# Altium schematic sheet Flomio BLE-NFC - Power.SchDoc: Flomio BLE-NFC::Power
size Tabloid; Author: Alex J. Tucker; CompanyName: Anidea Engineering, Inc.; DrawnBy: Alex J. Tucker; Engineer: Alex J. Tucker; Organization: Anidea Engineering, Inc.; Address1: 8020 Belvedere Rd.; Address2: Ste #1; Address3: West Palm Beach, FL; Address4: 33411    USA; DocumentNumber: 5; Revision: 3; SheetNumber: 5; SheetTotal: 5
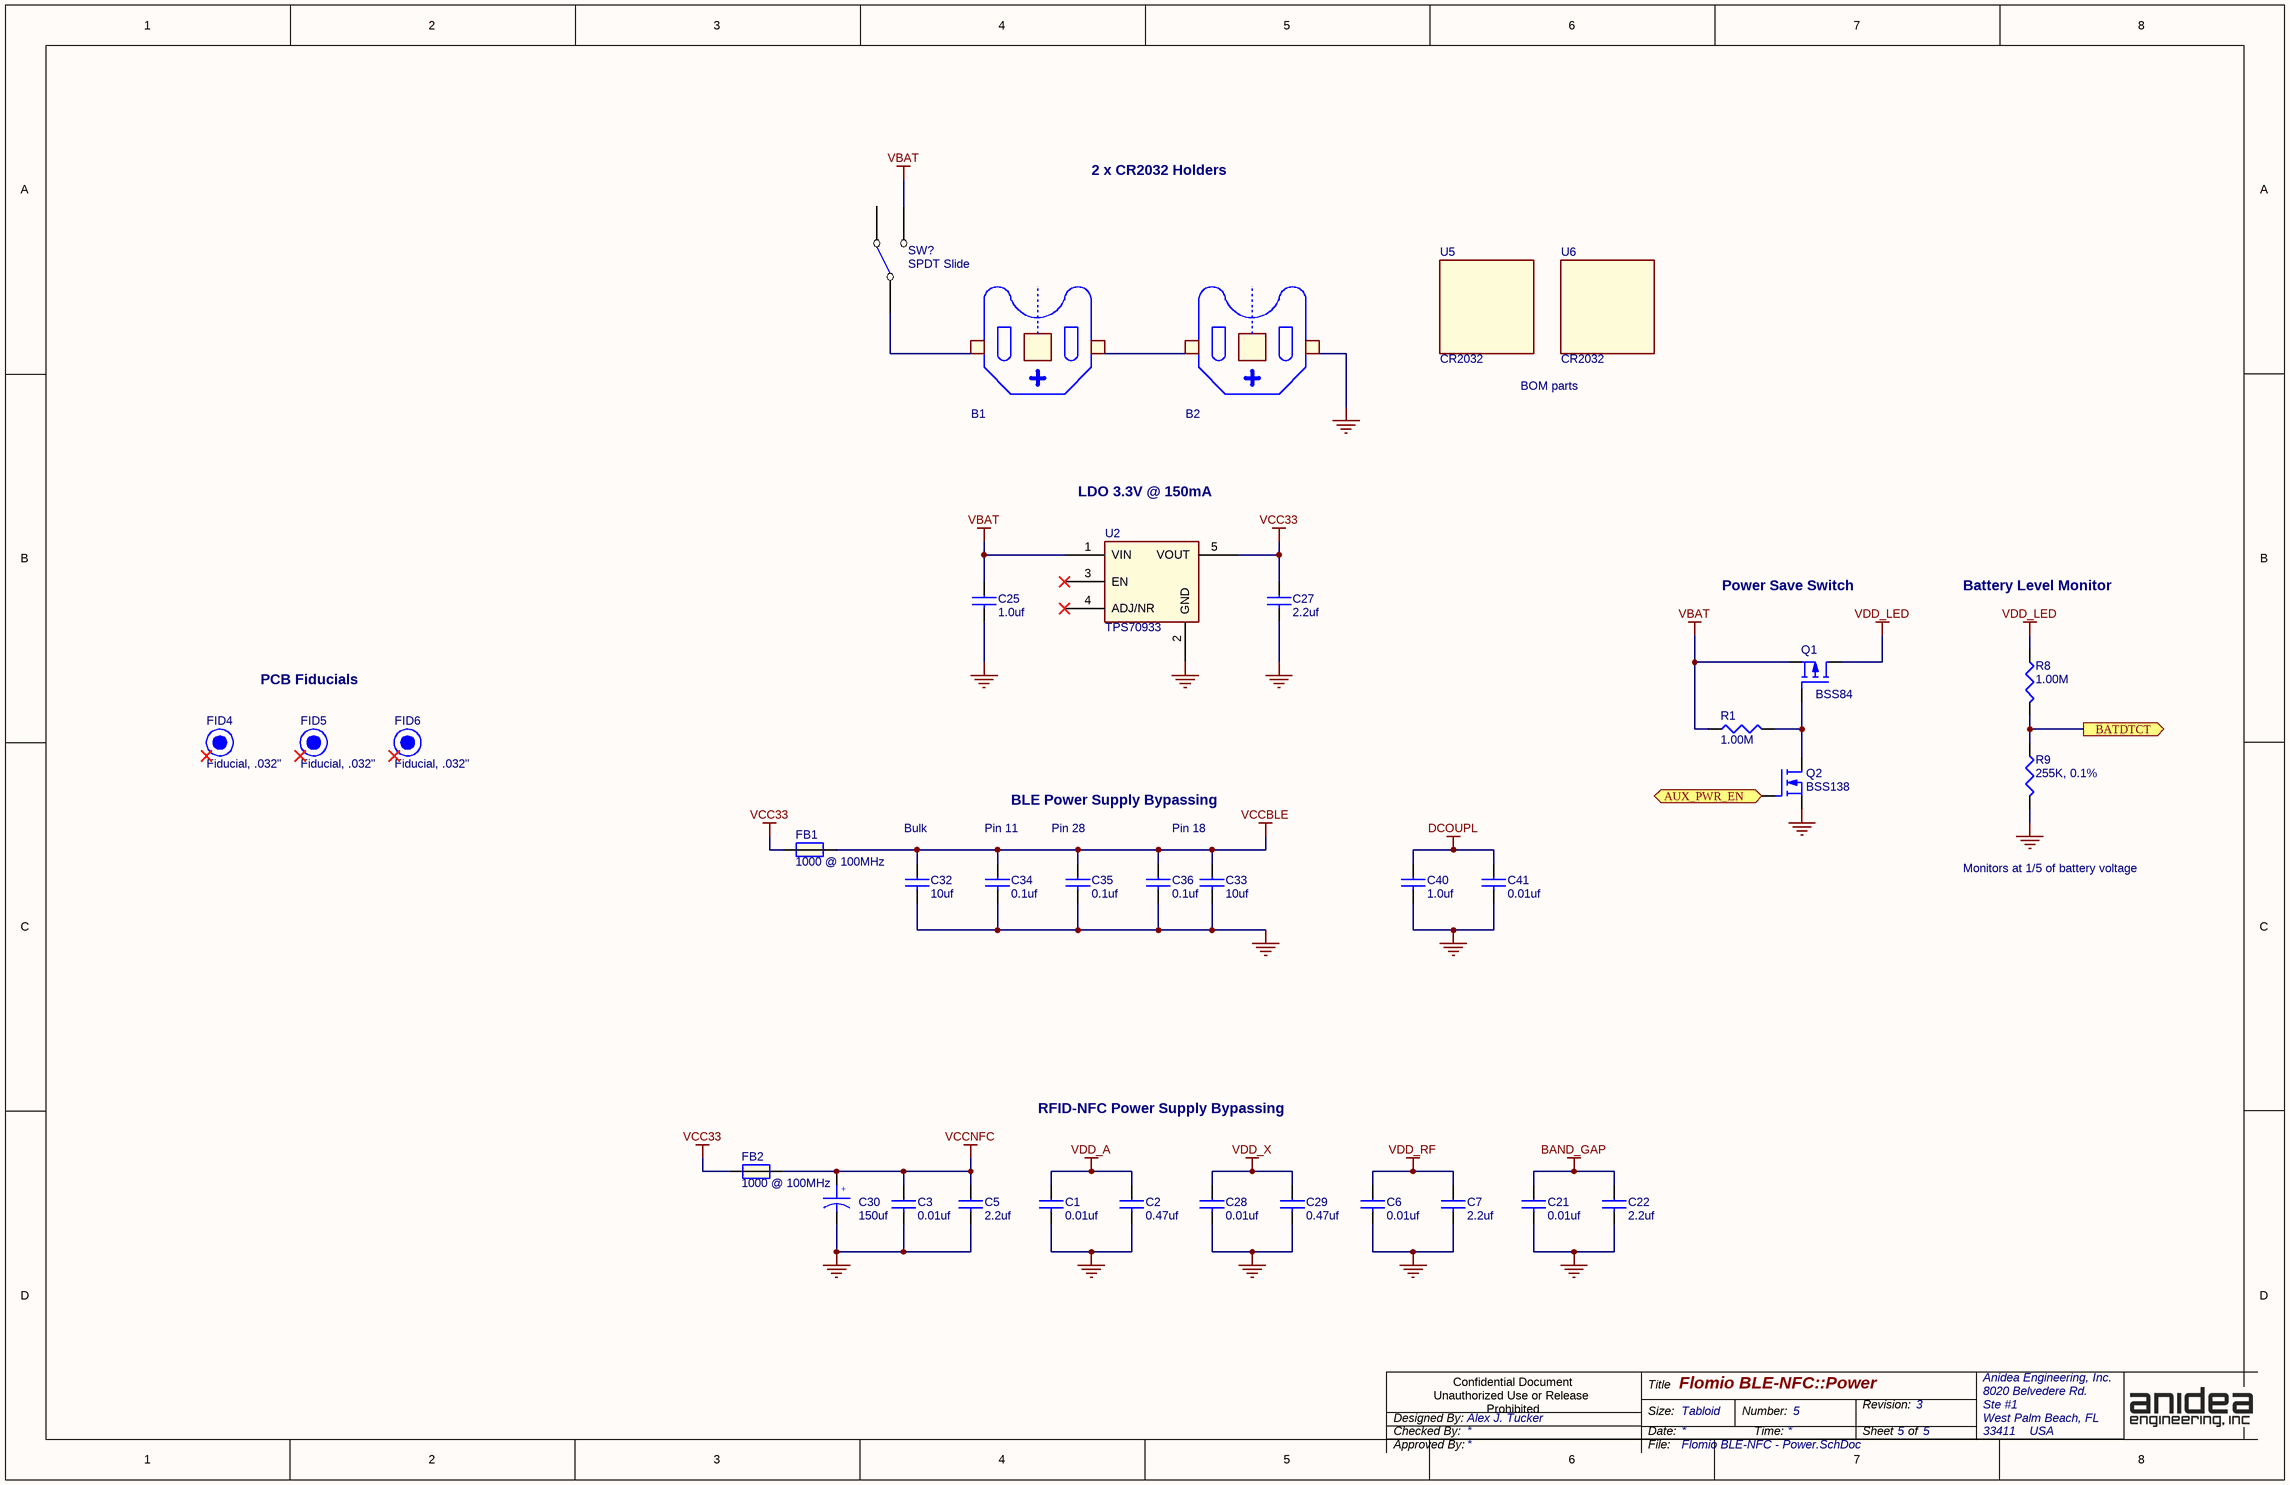
[diagram p0: Flomio BLE-NFC - Power.SchDoc]

## Parts
B1  CLIP  [BATT/BK-912]  (value not drawn)
B2  CLIP  [BATT/BK-912]  (value not drawn)
C1  0.01uf  [SM/C_0603]
C2  0.47uf  [SM/C_0603]
C3  0.01uf  [SM/C_0603]
C5  2.2uf  [SM/C_0603]
C6  0.01uf  [SM/C_0603]
C7  2.2uf  [SM/C_0603]
C21  0.01uf  [SM/C_0603]
C22  2.2uf  [SM/C_0603]
C25  1.0uf  [SM/C_0603]
C27  2.2uf  [SM/C_0603]
C28  0.01uf  [SM/C_0603]
C29  0.47uf  [SM/C_0603]
C30  150uf  [SM/C_2917(7343m)]
C32  10uf  [SM/C_0603]
C33  10uf  [SM/C_0603]
C34  0.1uf  [SM/C_0603]
C35  0.1uf  [SM/C_0603]
C36  0.1uf  [SM/C_0603]
C40  1.0uf  [SM/C_0603]
C41  0.01uf  [SM/C_0603]
FB1  1000 @ 100MHz  [SM/I_0603]
FB2  1000 @ 100MHz  [SM/I_0603]
FID4  Fiducial, .032"  [FID32]  (no BOM)
FID5  Fiducial, .032"  [FID32]  (no BOM)
FID6  Fiducial, .032"  [FID32]  (no BOM)
Q1  BSS84  [SOT23]
Q2  BSS138  [SOT23]
R1  1.00M  [SM/R_0603]
R8  1.00M  [SM/R_0603]
R9  255K, 0.1%  [SM/R_0603]
SW?  SPDT Slide  [SWITCH/CK/JS/SPDT]
U2  TPS70933  [SOT23-5]
U5  CR2032  (mechanical)
U6  CR2032  (mechanical)

## Ports
AUX_PWR_EN (in), BATDTCT (out)

## Nets
BAND_GAP: C21.1 C22.1
DCOUPL: C40.1 C41.1
GND: B2.3(P2) C1.2 C2.2 C3.2 C5.2 C6.2 C7.2 C21.2 C22.2 C25.2 C27.2 C28.2 C29.2 C30.2 C32.2 C33.2 C34.2 C35.2 C36.2 C40.2 C41.2 Q2.2(S) R9.2 U2.2(GND)
VBAT: C25.1 Q1.2(S) R1.1 SW?.3(NO) U2.1(VIN)
VCC33: C27.1 FB1.1 FB2.1 U2.5(VOUT)
VCCBLE: C32.1 C33.1 C34.1 C35.1 C36.1 FB1.2
VCCNFC: C3.1 C5.1 C30.1 FB2.2
VDD_A: C1.1 C2.1
VDD_LED: Q1.3(D) R8.1
VDD_RF: C6.1 C7.1
VDD_X: C28.1 C29.1
AUX_PWR_EN: Q2.1(G) ; port AUX_PWR_EN
BATDTCT: R8.2 R9.1 ; port BATDTCT
NetB1_2: B1.2(P1) SW?.1(COMMON)
NetB1_3: B1.3(P2) B2.2(P1)
NetQ1_1: Q1.1(G) Q2.3(D) R1.2

Not connected (* = marked no-connect by the designer): B1 1(M); B2 1(M); FID4 1*; FID5 1*; FID6 1*; SW? 2(NC); U2 3(EN)* 4(ADJ/NR)*

## Notes on the sheet
- 2 x CR2032 Holders
- BOM parts
- LDO 3.3V @ 150mA
- Power Save Switch
- Battery Level Monitor
- PCB Fiducials
- (near C32) Bulk
- (near C34) Pin 11
- BLE Power Supply Bypassing
- (near C35) Pin 28
- Pin 18
- Monitors at 1/5 of battery voltage
- RFID-NFC Power Supply Bypassing
- Confidential Document
  Unauthorized Use or Release
  Prohibited
- Checked By:
- Designed By:
- Title
- Size:
- Date:
- Tabloid
- Number:
- Time:
- Revision:
- Sheet
- of
- Approved By:
- File:
- (in symbol RVB0J151MNG) +

## Library data of the parts
B1 B2 = BK-912: Battery Holder, Retainer, C2032, Coin Cell, Surface Mount; Part Number: BK-912; Mfg: MPD; Mfg Part Number: BK-912; ComponentLink1Description: Local; ComponentLink1URL: \\newbrak\public\pdf\MPD BK-912 CR2032 Retainer.pdf; ComponentLink2Description: Web; ComponentLink2URL: http://www.memoryprotectiondevices.com/datasheets/BK-912-datasheet.pdf; Supplier Part Number 1: BK-912-ND; Supplier 1: Digi-Key; RoHS: True
C1 C3 C6 C21 C28 C41 = C0603C103M3RACTU: Cap, 0603, 0.01uf, 10000pf, 25V, 20%, X7R; Rating: -55°C ~ 125°C; Mfg: Vishay; Part Number: C0603C103M3RACTU; Tolerance: 20%; Voltage: 25V; Mfg Part Number: C0603C103M3RACTU; ComponentLink1Description: Local; ComponentLink1URL: \\brak\public\pdf\Kemet Ceramic X7R.pdf; ComponentLink2Description: Web; ComponentLink2URL: http://www.kemet.com/kemet/web/homepage/kechome.nsf/vapubfiles/KEM_C1002_X7R_SMD.pdf/$file/KEM_C1002_X7R_SMD.pdf; Supplier Part Number 1: 399-8989-1-ND; Supplier 1: Digi-Key; Supplier 2: AVX; Supplier Part Number 2: 06033C103MAT2A; Supplier 3: Digi-Key; Supplier Part Number 3: 478-7903-1-ND; RoHS: True
C2 C29 = GRM188R61A474KA61: Cap, 0603, 0.47uf, 10V, 10%, X5R; Mfg Part Number: GRM188R61A474KA61D; Mfg: Murata; Part Number: GRM188R61A474KA61; Tolerance: 10%; Voltage: 10V; ComponentLink1Description: Local; ComponentLink1URL: \\brak\public\pdf\Murata Cap PN.pdf; ComponentLink2Description: Web; Supplier Part Number 1: 490-1539-1-ND; Supplier 1: Digi-Key; RoHS: True
C5 C7 C22 C27 = GRM188R61A225ME34D: Cap, 0603, 2.2uf , 10V, 20%, X5R; Mfg: Murata; Part Number: GRM188R61A225ME34D; Tolerance: 20%; Voltage: 10V; Mfg Part Number: GRM188R61A225ME34D; ComponentLink1Description: Local; ComponentLink1URL: \\brak\public\pdf\Murata Cap PN.pdf; ComponentLink2Description: Web; Supplier Part Number 1: 490-1546-1-ND; Supplier 1: Digi-Key; RoHS: True
C25 C40 = GRM188R71A105KA61: Cap, 0603, 1.0uf, 10V, 10%, X7R; Mfg Part Number: GRM188R71A105KA61D; Mfg: Murata; Part Number: GRM188R71A105KA61; Tolerance: 10%; Voltage: 10V; ComponentLink1Description: Local; ComponentLink1URL: \\brak\public\pdf\Murata Cap PN.pdf; ComponentLink2Description: Web; Supplier Part Number 1: 490-3899-1-ND; Supplier 1: Digi-Key; RoHS: True
C30 = RVB0J151MNG: Cap, SMT 2917, 150uf, 6.3V, 20%, Al Ele; Mfg: Nichicon; Part Number: RVB0J151MNG; Tolerance: 20%; Voltage: 6.3V; Mfg Part Number: RVB0J151MNG; ComponentLink1Description: Local; ComponentLink1URL: \\brak\Public\pdf\Nichicon Type va_e Al El flat.pdf; ComponentLink2Description: Web; ComponentLink2URL: http://nichicon-us.com/english/products/pdfs/va_e.pdf; Supplier Part Number 1: 493-7063-1-ND; Supplier 1: Digi-Key; Supplier 2: Panasonic; Supplier Part Number 2: EEF-CX0J151XR; Supplier 3: Digi-Key; Supplier Part Number 3: PCE4940CT-ND; RoHS: True
C32 C33 = GRM1886ME47: Cap, 0603, 10uf, 6.3V, 20%, X5R; Mfg Part Number: GRM188R60J106ME47D; Mfg: Murata; Part Number: GRM1886ME47; Tolerance: 20%; Voltage: 6.3V; ComponentLink1Description: Local; ComponentLink1URL: \\newbrak\public\pdf\Murata Cap PN.pdf; ComponentLink2Description: Web; Supplier Part Number 1: 490-3896-1-ND; Supplier 1: Digi-Key; RoHS: True
C34-C36 = GRM188R71C104KA01: Cap, 0603, 0.1uf, 16V, 10%, X7R; Mfg Part Number: GRM188R71C104KA01D; Mfg: Murata; Part Number: GRM188R71C104KA01; Rating: X7R; Tolerance: 10%; Voltage: 16V; ComponentLink1Description: Local; ComponentLink1URL: \\brak\public\pdf\Murata Cap PN.pdf; ComponentLink2Description: Web; Supplier Part Number 1: 490-1532-1-ND; Supplier 1: Digi-Key; RoHS: True
FB1 FB2 = BLM18HE102SN1: EMI Bead, 0603, 1000 OHM @ 100MHz, Ferrite, .35 DCR; Mfg Part Number: BLM18HE102SN1D; Rating: 600mA; Mfg: Murata; Part Number: BLM18HE102SN1; ComponentLink1Description: Local; ComponentLink1URL: \\brak\public\pdf\Murata BLM18H Ferrite Bead.pdf; ComponentLink2Description: Web; ComponentLink2URL: http://search.murata.co.jp/Ceramy/image/img/PDF/ENG/L0110S0101BLM18H.pdf; Supplier Part Number 1: 490-5215-1-ND; Supplier 1: Digi-Key; RoHS: True
FID4-FID6 = FID32: Fiducual, .032" Pad; Obsolete: False; Part Number: FID32; ComponentLink1Description: Local; ComponentLink1URL: \\brak\public\pdf\; ComponentLink2Description: Web; RoHS: False; Part Type: Misc\Fiducual
Q1 = BSS84: Transistor, P-Mosfet, 130ma, 50V; Mfg Part Number: BSS84LT1; Mfg: On Semi; Part Number: BSS84; Rating: 130MA; ComponentLink1Description: Local; ComponentLink1URL: \\newbrak\public\pdf\OnSemi BSS84LT1.pdf; ComponentLink2Description: Web; Supplier Part Number 1: BSS84CT-ND; Supplier 1: Digi-Key; RoHS: True
Q2 = BSS138: Transistor, N-Mosfet, 200ma, 50V; Mfg Part Number: BSS138LT1; Mfg: On Semi; Part Number: BSS138; Rating: 200MA; Voltage: 50V; ComponentLink1Description: Local; ComponentLink1URL: \\newbrak\public\pdf\OnSemi BSS138.pdf; ComponentLink2Description: Web; Supplier Part Number 1: BSS138CT-ND; Supplier 1: Digi-Key; RoHS: True
R1 R8 = CRCW06031M00F: Resistor, 0603, 1.00M Ohm 1%; Mfg Part Number: CRCW06031M00FKEA; Rating: 1/10W; Mfg: Vishay; Part Number: CRCW06031M00F; Tolerance: 1%; ComponentLink1Description: Local; ComponentLink1URL: \\brak\public\pdf\Vishay CRCW Resistors.pdf; ComponentLink2Description: Web; ComponentLink2URL: http://www.vishay.com/doc?20035; Supplier Part Number 1: 541-1.00MHCT-ND; Supplier 1: Digi-Key; Supplier 2: Yageo; Supplier Part Number 2: RC0603FR-071ML; Supplier 3: Digi-Key; Supplier Part Number 3: 311-1.00MHRCT-ND; RoHS: True
R9 = ERA-3AEB2553V: Resistor, 0603, 255K Ohm, 0.1%; Rating: 1/10W; Mfg: Panasonic; Part Number: ERA-3AEB2553V; Tolerance: 0.1%; Mfg Part Number: ERA-3AEB2553V; ComponentLink1Description: Local; ComponentLink1URL: \\brak\public\pdf\Panasonic ERA High Reliability Chip Res.pdf; ComponentLink2Description: Web; ComponentLink2URL: http://industrial.panasonic.com/www-data/pdf/AOA0000/AOA0000CE26.pdf; Supplier Part Number 1: P255KDBCT-ND; Supplier 1: Digi-Key; RoHS: True
SW? = JS102011SAQN: Switch, Slide, SPDT, 2 Position, RA, Miniature; Rating: .3A @ 6V; Mfg: C & K; Part Number: JS102011SAQN; Mfg Part Number: JS102011SAQN; ComponentLink1Description: Local; ComponentLink1URL: \\newbrak\public\pdf\C&K JS Series Sub Miniature Switch.pdf; ComponentLink2Description: Web; ComponentLink2URL: http://www.ck-components.com/index.php?module=media&action=Display&cmpref=14398&lang=en&width=&height=&format=&alt=; Supplier Part Number 1: 401-1999-1-ND; Supplier 1: Digi-Key; RoHS: True
U2 = TPS70933DBVR: Regulator, 3.3V, LDO, 150mA, Linear Regulator, 1uA Iq, Vin 2.7-30 V; Mfg: TI; Part Number: TPS70933DBVR; Rating: 150mA; Mfg Part Number: TPS70933DBVR; ComponentLink1Description: Local; ComponentLink1URL: \\brak\public\pdf\TI TPS709xx LDO 1uA Iq.pdf; ComponentLink2Description: Web; ComponentLink2URL: http://www.ti.com/lit/ds/symlink/tps70933.pdf; Supplier Part Number 1: 296-35483-1-ND; Supplier 1: Digi-Key; RoHS: True
U5 U6 = CR2032: Battery, 2032, 225mAh; Mfg: Panasonic; Part Number: CR2032; Mfg Part Number: CR2032; ComponentLink1Description: Local; ComponentLink1URL: \\newbrak\public\pdf\Panasonic CR Series Datasheets Merged.pdf; ComponentLink2Description: Web; ComponentLink2URL: http://na.industrial.panasonic.com/sites/default/pidsa/files/crseries_datasheets_merged.pdf; Supplier Part Number 1: P189-ND; Supplier 1: Digi-Key; RoHS: True